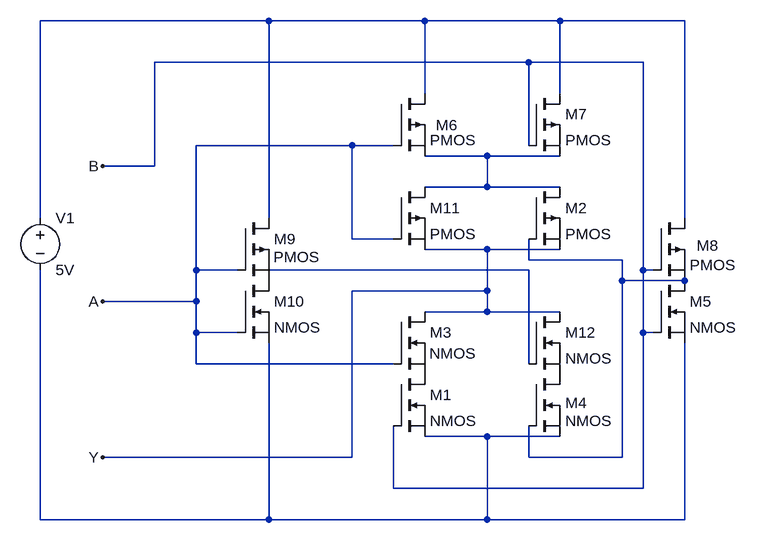
[diagram p0: schematic Project 4.asc]
Project 4.asc, the LTspice schematic file:
Version 4.1
SHEET 1 1140 756
WIRE 0 -352 -352 -352
WIRE 240 -352 0 -352
WIRE 448 -352 240 -352
WIRE 640 -352 448 -352
WIRE 400 -288 -176 -288
WIRE 576 -288 400 -288
WIRE 240 -240 240 -352
WIRE 448 -240 448 -352
WIRE 128 -160 -112 -160
WIRE 192 -160 128 -160
WIRE 400 -160 400 -288
WIRE 336 -144 240 -144
WIRE 448 -144 336 -144
WIRE -176 -128 -176 -288
WIRE -176 -128 -256 -128
WIRE 336 -96 336 -144
WIRE 336 -96 240 -96
WIRE 448 -96 336 -96
WIRE -352 -48 -352 -352
WIRE 0 -48 0 -352
WIRE 640 -48 640 -352
WIRE 128 -16 128 -160
WIRE 192 -16 128 -16
WIRE 336 0 240 0
WIRE 448 0 336 0
WIRE 400 16 400 -16
WIRE 544 16 400 16
WIRE -112 32 -112 -160
WIRE -48 32 -112 32
WIRE 400 32 0 32
WIRE 576 32 576 -288
WIRE 592 32 576 32
WIRE 544 48 544 16
WIRE 640 48 544 48
WIRE 336 64 336 0
WIRE 336 64 128 64
WIRE -112 80 -112 32
WIRE -112 80 -256 80
WIRE 336 96 336 64
WIRE 336 96 240 96
WIRE 448 96 336 96
WIRE -112 128 -112 80
WIRE -48 128 -112 128
WIRE 576 128 576 32
WIRE 592 128 576 128
WIRE -112 176 -112 128
WIRE 192 176 -112 176
WIRE 400 176 400 32
WIRE 336 288 240 288
WIRE 448 288 336 288
WIRE 128 320 128 64
WIRE 128 320 -256 320
WIRE 400 320 400 272
WIRE 544 320 544 48
WIRE 544 320 400 320
WIRE 192 368 192 272
WIRE 576 368 576 128
WIRE 576 368 192 368
WIRE -352 416 -352 32
WIRE 0 416 0 144
WIRE 0 416 -352 416
WIRE 336 416 336 288
WIRE 336 416 0 416
WIRE 640 416 640 144
WIRE 640 416 336 416
FLAG -256 80 A
FLAG -256 -128 B
FLAG -256 320 Y
SYMBOL pmos -48 -48 R0
WINDOW 3 55 60 Left 2
SYMATTR InstName M9
SYMBOL nmos -48 48 R0
SYMATTR InstName M10
SYMBOL pmos 192 -96 R0
SYMATTR InstName M11
SYMBOL nmos 400 96 R0
SYMATTR InstName M12
SYMBOL pmos 192 -240 R0
WINDOW 0 65 49 Left 2
SYMATTR InstName M6
SYMBOL pmos 400 -240 R0
SYMATTR InstName M7
SYMBOL pmos 400 -96 R0
SYMATTR InstName M2
SYMBOL pmos 592 -48 R0
WINDOW 0 67 42 Left 2
SYMATTR InstName M8
SYMBOL nmos 192 192 R0
SYMATTR InstName M1
SYMBOL nmos 400 192 R0
WINDOW 0 56 44 Left 2
SYMATTR InstName M4
SYMBOL nmos 192 96 R0
WINDOW 3 55 64 Left 2
SYMATTR InstName M3
SYMBOL nmos 592 48 R0
SYMATTR InstName M5
SYMBOL voltage -352 -64 R0
SYMATTR InstName V1
SYMATTR Value 5V

The netlist it stands for:
* Project 4.asc
M9 N001 A P001 P001 PMOS
M10 P001 A N005 N005 NMOS
M11 N002 A Y Y PMOS
M12 Y N004 P002 P002 NMOS
M6 N001 A N002 N002 PMOS
M7 N001 B N002 N002 PMOS
M2 N002 N003 Y Y PMOS
M8 N001 B N003 N003 PMOS
M1 P003 B N005 N005 NMOS
M4 P002 N003 N005 N005 NMOS
M3 Y A P003 P003 NMOS
M5 N003 B N005 N005 NMOS
V1 N001 N005 5V
.model NMOS NMOS
.model PMOS PMOS
.lib standard.mos
.backanno
.end